# Altium project PRJ-IECA-01-21.PrjPcb
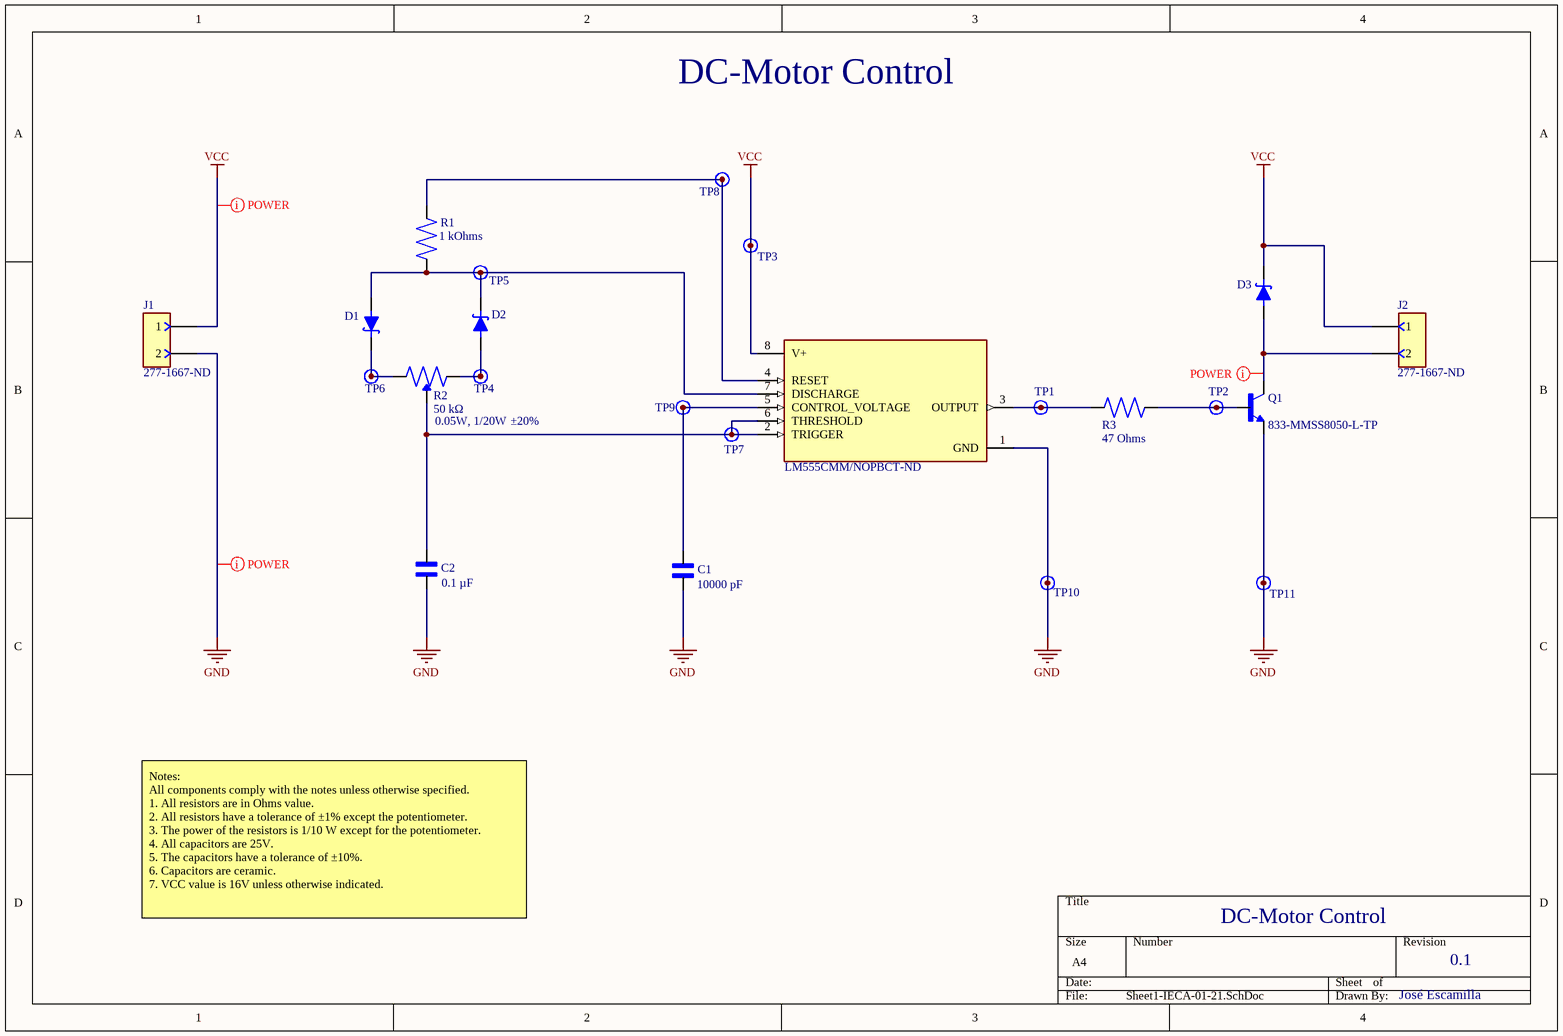
[diagram p0: Sheet1-IECA-01-21.SchDoc]
1 sheet, 23 parts. Net scope: global (net labels, ports and power ports of the same name join across sheets).
Board file: PCB1-IECA-01-21.PcbDoc

## Sheet Sheet1-IECA-01-21.SchDoc: DC-Motor Control
size A4; Date: 19/01/2021; Author: José Escamilla; DrawnBy: José Escamilla; DocumentNumber: IECA-007-01-SCH; Revision: 0.1; SheetNumber: 1; SheetTotal: 1; Size: Letter

### Parts
C1  10000 pF  [CAP0603_C0603C103K3HACTU]
C2  0.1 µF  [CAP0603_C0603C104K3RAC7081]
D1  SD103CW-FDIDKR-ND  [SD103CW-13-F]  (value not drawn)
D2  SD103CW-FDIDKR-ND  [SD103CW-13-F]  (value not drawn)
D3  SD103CW-FDIDKR-ND  [SD103CW-13-F]  (value not drawn)
J1  277-1667-ND  [TB_2PIN_1935161]
J2  277-1667-ND  [TB_2PIN_1935161]
Q1  833-MMSS8050-L-TP  [SOT23-MMSS8050-L-TP]
R1  1 kOhms  [RES0603_ERJU03F1001V]
R2  50 kΩ  Tolerance: ±20%  Power (Watts): 0.05W, 1/20W  [PRS11S-N20F-503B1]
R3  47 Ohms  [RES0603_ERJU03F47R0V]
TP1  TP  [TP]  (value not drawn)
TP2  TP  [TP]  (value not drawn)
TP3  TP  [TP]  (value not drawn)
TP4  TP  [TP]  (value not drawn)
TP5  TP  [TP]  (value not drawn)
TP6  TP  [TP]  (value not drawn)
TP7  TP  [TP]  (value not drawn)
TP8  TP  [TP]  (value not drawn)
TP9  TP  [TP]  (value not drawn)
TP10  TP  [TP]  (value not drawn)
TP11  TP  [TP]  (value not drawn)
U1  LM555CMM/NOPBCT-ND  [LM555SOP65P490X110-8N]

### Nets
GND: C1.2 C2.2 J1.2 Q1.2(E) TP10.1 TP11.1 U1.1(GND)
VCC: D3.C(K) J1.1 J2.1 TP3.1 U1.8(V+)
NetC1_1: C1.1 TP9.1 U1.5(CONTROL_VOLTAGE)
NetC2_1: C2.1 R2.2(W) TP7.1 U1.2(TRIGGER) U1.6(THRESHOLD)
NetD1_A: D1.A D2.C(K) R1.1 TP5.1 U1.7(DISCHARGE)
NetD1_C: D1.C(K) R2.1(CCW) TP6.1
NetD2_A: D2.A R2.3(CW) TP4.1
NetD3_A: D3.A J2.2 Q1.3(C)
NetQ1_1: Q1.1(B) R3.2 TP2.1
NetR1_2: R1.2 TP8.1 U1.4(RESET)
NetR3_1: R3.1 TP1.1 U1.3(OUTPUT)

### Layout directives
net class POWER: GND, NetD3_A, VCC

### Notes on the sheet
- Notes:
  All components comply with the notes unless otherwise specified.
  1. All resistors are in Ohms value.
  2. All resistors have a tolerance of ±1% except the potentiometer.
  3. The power of the resistors is 1/10 W except for the potentiometer.
  4. All capacitors are 25V.
  5. The capacitors have a tolerance of ±10%.
  6. Capacitors are ceramic.
  7. VCC value is 16V unless otherwise indicated.

### Library data of the parts
C1 = C0603C103K3HAC7867: 10000 pF ±10% 25V Ceramic Capacitor X8R 0603 (1608 Metric).; Manufacturer: KEMET; Base Product Number: C0603C; Category: Capacitors Ceramic Capacitors; Series: SMD Comm X8R HT150C; Capacitance: 10000 pF; Tolerance: ±10%; Voltage - Rated: 25V; Temperature Coefficient: X8R; Operating Temperature: -55°C ~ 150°C; Applications: General Purpose; Mounting Type: Surface Mount, MLCC; Package / Case: 0603 (1608 Metric); Size / Dimension: 0.063" L x 0.031" W (1.60mm x 0.80mm); Thickness (Max): 0.034" (0.87mm); Supplier 1: Digi-Key; Supplier Part Number 1: 399-C0603C103K3HAC7867CT-ND
C2 = C0603C104K3RAC7081: 0.1 µF ±10% 25V Ceramic Capacitor X7R 0603 (1608 Metric).; Manufacturer: KEMET; Base Product Number: C0603C; Supplier 1: Digi-Key; Category: Capacitors Ceramic Capacitors; Series: SMD Comm X7R; Capacitance: 0.1 µF; Tolerance: ±10%; Voltage - Rated: 25V; Temperature Coefficient: X7R; Operating Temperature: -55°C ~ 125°C; Applications: Bypass, Decoupling; Mounting Type: Surface Mount, MLCC; Package / Case: 0603 (1608 Metric); Size / Dimension: 0.063" L x 0.031" W (1.60mm x 0.80mm); Thickness (Max): 0.037" (0.95mm); Supplier Part Number 1: 399-C0603C104K3RAC7081CT-ND
D1-D3 = SD103CW-13-F: Diode Schottky 20 V 350mA (DC) Surface Mount SOD-123.; Manufacturer: Diodes Incorporated; Voltage - DC Reverse (Vr) (Max): 20 V; Voltage - Forward (Vf) (Max) @ If: 600 mV @ 200 mA; Speed: Fast Recovery =< 500ns, > 200mA (Io); Reverse Recovery Time (trr): 10 ns; Current - Reverse Leakage @ Vr: 5 µA @ 10 V; Capacitance @ Vr, F: 28pF @ 0V, 1MHz; Supplier 1: Digi-Key; Category: Discrete Semiconductor Products Diodes - Rectifiers - Single; Diode Type: Schottky; Current - Average Rectified (Io): 350mA (DC); Mounting Type: Surface Mount; Package / Case: SOD-123; Operating Temperature - Junction: -65°C ~ 125°C; Supplier Part Number 1: SD103CW-FDIDKR-ND
J1 J2 = 1935161: 2 Position Wire to Board Terminal Block Horizontal with Board 0.197" (5.00mm) Through Hole.; Manufacturer: Phoenix Contact; Current: 18 A; Voltage: 300 V; Wire Gauge: 12-26 AWG; Pitch: 0.197" (5.00mm); Supplier 1: Digi-Key; Mating Orientation: Horizontal with Board; Mounting Type: Through Hole; Housing Material: Polyamide (PA), Nylon; Contact Material: Plating; Category: Connectors, Interconnects; Series: COMBICON PT; Supplier Part Number 1: 277-1667-ND
Q1 = MMSS8050-L-TP: Bipolar (BJT) Transistor NPN 25 V 1.5 A 100MHz 625 mW Surface Mount SOT-23.; Manufacturer: Micro Commercial Co; Current - Collector (Ic) (Max): 1.5 A; Voltage - Collector Emitter Breakdown (Max): 25 V; Vce Saturation (Max) @ Ib, Ic: 500mV @ 80mA, 800mA; Current - Collector Cutoff (Max): 100nA; DC Current Gain (hFE) (Min) @ Ic, Vce: 120 @ 100mA, 1V; Power - Max: 625 mW; Supplier 1: Mouser; Category: Discrete Semiconductor Products Transistors - Bipolar (BJT) - Single; Transistor Type: NPN; Frequency - Transition: 100MHz; Operating Temperature: -55°C ~ 150°C (TJ); Package / Case: TO-236-3, SC-59, SOT-23-3; Base Product Number: MMSS8050; Supplier Part Number 1: 833-MMSS8050-L-TP
R1 = ERJU03F1001V: 1 kOhms ±1% 0.1W, 1/10W Chip Resistor 0603 (1608 Metric) Anti-Sulfur, Automotive AEC-Q200 Thick Film.; Manufacturer: Panasonic Electronic Components; Base Product Number: ERJ-U03; Temperature Coefficient: ±100ppm/°C; Resistance: 1 kOhms; Composition: Thick Film; Features: Anti-Sulfur, Automotive AEC-Q200; Category: Resistors Chip Resistor - Surface Mount; ComponentLink1Description: https://www.digikey.com.mx/en/products/detail/panasonic-electronic-components/ERJ-U03F1001V/11641677?utm_source=snapeda&utm_medium=aggregator&utm_campaign=buynow; ComponentLink1URL: *; Tolerance: ±1%; Height - Seated (Max): 0.022" (0.55mm); Operating Temperature: -55°C ~ 155°C; Series: ERJ-U03; Size / Dimension: 0.063" L x 0.031" W (1.60mm x 0.80mm); Power (Watts): 0.1W, 1/10W; Package / Case: 0603 (1608 Metric); Supplier 1: Digi-Key; Supplier Part Number 1: 10-ERJ-U03F1001VCT-ND
R2 = PRS11S-N20F-503B1: 50k Ohm 1 Gang Linear Surface Mount Potentiometer None 1.0 Kierros Carbon 0.05W, 1/20W Gull Wing.; Manufacturer: Bourns Inc.; Adjustment Type: Top Adjustment; Rotation: 300°; Actuator Type: Flatted; Actuator Length: 0.787" (20.00mm); Actuator Diameter: 0.236" (6.00mm); Base Product Number: PRS11S; Supplier 1: Digi-Key; Category: Potentiometers, Variable Resistors Rotary Potentiometers, Rheostats; Series: Pro Audio PRS11S; Resistance: 50 kΩ; Taper: Linear; Resistive Material: Carbon; Termination Style: Gull Wing; Mounting Type: Surface Mount; Size - Body: Rectangular - 0.512" x 0.461" Face x 0.283" H (13.00mm x 11.70mm x 7.20mm); Supplier Part Number 1: PRS11S-N20F-503B1-ND
R3 = ERJ-U03F47R0V: 47 Ohms ±1% 0.1W, 1/10W Chip Resistor 0603 (1608 Metric) Anti-Sulfur, Automotive AEC-Q200 Thick Film.; Manufacturer: Panasonic Electronic Components; Temperature Coefficient: ±100ppm/°C; Base Product Number: ERJ-S03; Supplier 1: Digi-Key; Category: Resistors Chip Resistor - Surface Mount; Series: ERJ-S03; Power (Watts): 0.1W, 1/10W; Tolerance: ±1%; Composition: Thick Film; Features: Anti-Sulfur, Automotive AEC-Q200; Operating Temperature: -55°C ~ 155°C; Package / Case: 0603 (1608 Metric); Size / Dimension: 0.063" L x 0.031" W (1.60mm x 0.80mm); Height - Seated (Max): 0.022" (0.55mm); Resistance: 47 Ohms; Supplier Part Number 1: 10-ERJ-U03F47R0VCT-ND
U1 = LM555CMM/NOPB: 555 Type, Timer/Oscillator (Single) IC 100kHz 8-VSSOP.; Manufacturer: Texas Instruments; Voltage - Supply: 4.5V ~ 16V; Current - Supply: 10 mA; Base Product Number: LM555; Supplier 1: Digi-Key; Category: Integrated Circuits (ICs) Clock/Timing - Programmable Timers and Oscillators; Type: 555 Type, Timer/Oscillator (Single); Frequency: 100kHz; Operating Temperature: 0°C ~ 70°C; Package / Case: 8-TSSOP, 8-MSOP (0.118", 3.00mm Width); Mounting Type: Surface Mount; Manufacturer Product Number: LM555CMM/NOPB; Supplier Part Number 1: LM555CMM/NOPBCT-ND